# Altium schematic sheet 01-POWER.SchDoc
size A4; SheetNumber: 1; SheetTotal: 1
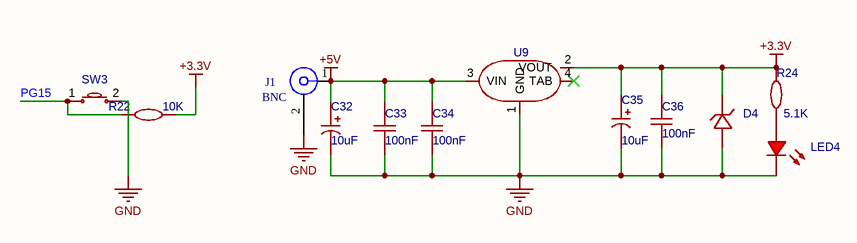
[diagram p0: 01-POWER.SchDoc]

## Parts
C32  value 10uF  [CAP-SMD_L3.5-W2.8]  (hidden comment: CA45-B-16V-4.7μF-K)
C33  value 100nF  [C0603]  (hidden comment: CAP_0603)
C34  value 100nF  [C0603]  (hidden comment: CAP_0603)
C35  value 10uF  [CAP-SMD_L3.5-W2.8]  (hidden comment: CA45-B-16V-4.7μF-K)
C36  value 100nF  [C0603]  (hidden comment: CAP_0603)
D4  SMBJ3.3A_C362089  [SMB_L4.6-W3.6-LS5.3-RD]  (value not drawn)
J1  BNC  [DC-005B]
LED4  LED_0603-R  [LED_0603]  (value not drawn)
R22  value 10K  [R0603]  (hidden comment: Res_0603)
R24  value 5.1K  [R0603]  (hidden comment: Res_0603)
SW3  (no value)  [Key_SMD_3.6x6.1x2.5]
U9  AMS1117  [SOT_223]  (value not drawn)

## Nets
+3.3V: C35.1 C36.2 D4.1 R22.1 R24.1 U9.2(VOUT)
+5V: C32.1 C33.2 C34.2 J1.1(CENTER) U9.3(VIN)
GND: C32.2 C33.1 C34.1 C35.2 C36.1 D4.2 J1.2(SHIELD) LED4.1(C) SW3.2 U9.1(GND)
PG15: R22.2 SW3.1
NetLED4_2: LED4.2(A) R24.2

Not connected (* = marked no-connect by the designer): U9 4(TAB)*

## Library data of the parts
C32 C35 = CA45-B-16V-4.7μF-K: 容值:4.7uF;精度:±10%;额定电压:16V;等效串联电阻:3.5Ω@100kHz;; Manufacturer: TORCH(火炬); AddInBom: yes; ModelId: 0dfcda272f9b43668c6086d3a08712ba; ModelName: CASE-B_L3.5-W2.8-H1.9; ModelTransform: 145.669,110.236,0,180,0,0,0,0,0; Tolerance: ±10%; Rated Voltage: 16V; Symbol: CA45-B-16V-4.7μF-K; Device: CA45-B-16V-4.7μF-K; LCSC Part Name: 4.7uF ±10% 16V; ManufacturerPart: CA45-B-16V-4.7μF-K; Supplier Footprint: 1210; JLCPCB Part Class: Extended Part; Datasheet: https://atta.szlcsc.com/upload/public/pdf/source/20191009/C435293_78A410F3D73489DBEAC46056C4262F7A.pdf; Supplier: LCSC; ConvertToPcb: yes; FootprintName: CAP-SMD_L3.5-W2.8; Equivalent Series Resistance(ESR): 3.5Ω@100kHz; Operating Temperature: -55℃~+125℃
C33 C34 C36 = CAP_0603: ConvertToPcb: yes; SymbolName: CapAcitance; ModelId: ac125912035d415993ca9572d50418b1; ModelName: C0603_L1.6-W0.8-H0.8; ModelTransform: 62.992,31.496,0,0,0,0,0,0,0; Device: CAP_0603; AddInBom: yes; Supplier Footprint: 0603; FootprintName: C0603
D4 = SMBJ3.3A_C362089: 反向截止电压(Vrwm):3.3V;击穿电压:4.1V;最大钳位电压:7.3V;; Manufacturer: JKSEMI(金开盛); AddInBom: yes; ModelId: 5e8926c661484ff2a35b83e5ae62aeb9; ModelTransform: 212.598,141.732,0,0,0,0,0,0,0; Unidirectional Channels: 1; Bidirectional Channels: 0; Reverse Stand-Off Voltage (Vrwm): 3.3V; Breakdown Voltage: 4.1V; Maximum Clamping Voltage: 7.3V; Peak Pulse Power Dissipation (Ppp)@10/1000us: 600W; Symbol: SMBJ3.3A_C362089; Device: SMBJ3.3A_C362089; LCSC Part Name: 单向TVS 3.3V截止 600W峰值脉冲功率; SupplierPart: C362089; ManufacturerPart: SMBJ3.3A; Supplier Footprint: SMB(DO-214AA); JLCPCB Part Class: Extended Part; Datasheet: https://atta.szlcsc.com/upload/public/pdf/source/20200731/C362089_3B984BF84356FE4A5051ADB3F5B1E766.pdf; Supplier: LCSC; ConvertToPcb: yes; FootprintName: SMB_L4.6-W3.6-LS5.3-RD; ModelName: SMB_L4.6-W3.6-LS5.3-RD
J1 = BNC: PCB DECAL: RCA-101; SOURCE_PATH: C:\PROGRAM FILES\印院出品\CAPTURE 16.2\LIBRARY\CONNECTOR.OLB; VALUE: BNC
LED4 = LED_0603-R: Symbol: LED_R; Convert to PCB: yes; 3D Model: dd8257b0d61a4cd7b68939a056e08095; 3D Model Transform: 58.72,29.4,22.03,0,0,0,0,0,0; ModelName: LED-0603_R; Device: LED_0603-R; Add into BOM: yes; Supplier Footprint: 0603; FootprintName: LED_0603
R22 R24 = Res_0603: Symbol: 电阻; ConvertToPcb: yes; ModelId: fc143cca1e79419f9cd78b61e9279f08; ModelTransform: 31.8897,63.7794,0,90,0,0,0,0,0; Device: Res_0603; AddInBom: yes; Supplier Footprint: 0603; FootprintName: R0603; ModelName: R0603
SW3 = Key_SMD_3.6x6.1x2.5: SymbolName: 轻触按键x2; AddInBom: yes; ModelId: 90d18ad19a7e424ebd3215e1b5dcb80c聨0819f05c4eef4c71ace90d822a990e87; ModelName: KEY-SMD_2P-L6.0-W3.6-H2.5-LS8.0 COPY; ModelTransform: 311.02,141.73,102.36,0,0,0,0,0,0; Device: Key_SMD_3.6x6.1x2.5; ConvertToPcb: yes; FootprintName: Key_SMD_3.6x6.1x2.5; Supplier Footprint: SMD
U9 = AMS1117: AddInBom: yes; ModelId: 925194bf9823436183a3e0b978a8d076聨0819f05c4eef4c71ace90d822a990e87; ModelName: SOT-223-4P_L6.5-W3.5-H1.6-LS7.0-P2.30; ModelTransform: 279.84,255.85,68.86,90,0,0,0,0,0; Symbol: AMS1117; Device: AMS1117; ConvertToPcb: yes; FootprintName: SOT_223; Supplier Footprint: SOT_223